# Altium schematic sheet Sheet1.SchDoc
size A
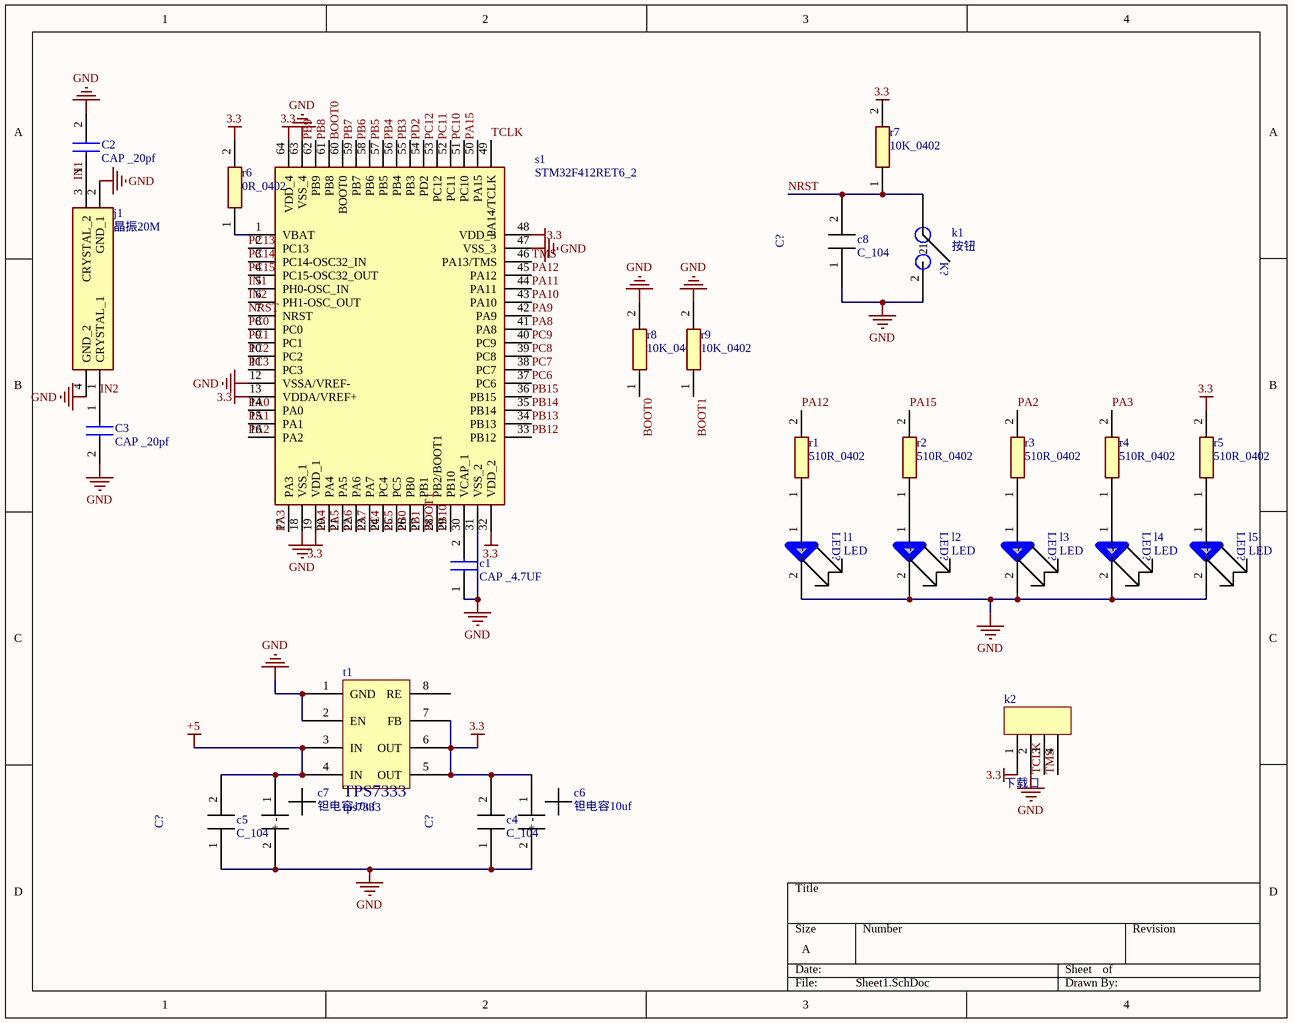
[diagram p0: Sheet1.SchDoc]

## Parts
c1  CAP _4.7UF  [cap_0402]
C2  CAP _20pf  [cap_0402]
C3  CAP _20pf  [cap_0402]
c4  C_104  [RC0603]
c5  C_104  [RC0603]
c6  钽电容10uf  [钽电容10uf 3216]
c7  钽电容10uf  [钽电容10uf 3216]
c8  C_104  [RC0603]
j1  晶振20M  [晶振20M]
k1  按钮  [SMT-KEY]
k2  下载口  [贴片4位接口]
l1  LED  [LED0805]
l2  LED  [LED0805]
l3  LED  [LED0805]
l4  LED  [LED0805]
l5  LED  [LED0805]
r1  510R_0402  [RC0402]
r2  510R_0402  [RC0402]
r3  510R_0402  [RC0402]
r4  510R_0402  [RC0402]
r5  510R_0402  [RC0402]
r6  0R_0402  [RC0402]
r7  10K_0402  [RC0402]
r8  10K_0402  [RC0402]
r9  10K_0402  [RC0402]
s1  STM32F412RET6_2  [stm32f412ret6 _2]
t1  tps7333  [SOIC-8P]

## Nets
3.3: c4.2 c6.1(+) k2.1 r5.2 r6.2 s1.13(VDDA/VREF+) s1.19(VDD_1) s1.32(VDD_2) s1.48(VDD_3) s1.64(VDD_4) t1.5(OUT) t1.6(OUT) t1.7(FB)
+5: c5.2 c7.1(+) t1.3(IN) t1.4(IN)
GND: c1.1 C2.2 C3.2 c4.1 c5.1 c6.2(-) c7.2(-) c8.1 j1.2(GND_1) j1.4(GND_2) k1.2 k2.2 l1.2(-) l2.2(-) l3.2(-) l4.2(-) l5.2(-) r8.2 r9.2 s1.12(VSSA/VREF-) s1.18(VSS_1) s1.31(VSS_2) s1.47(VSS_3) s1.63(VSS_4) t1.1(GND) t1.2(EN)
BOOT0: r8.1 s1.60(BOOT0)
BOOT1: r9.1 s1.28(PB2/BOOT1)
IN1: C2.1 j1.3(CRYSTAL_2) s1.5(PH0-OSC_IN)
IN2: C3.1 j1.1(CRYSTAL_1) s1.6(PH1-OSC_OUT)
NRST: c8.2 k1.1 r7.1 s1.7(NRST)
PA0: s1.14(PA0)
PA1: s1.15(PA1)
PA2: r3.2 s1.16(PA2)
PA3: r4.2 s1.17(PA3)
PA4: s1.20(PA4)
PA5: s1.21(PA5)
PA6: s1.22(PA6)
PA7: s1.23(PA7)
PA8: s1.41(PA8)
PA9: s1.42(PA9)
PA10: s1.43(PA10)
PA11: s1.44(PA11)
PA12: r1.2 s1.45(PA12)
PA15: r2.2 s1.50(PA15)
PB0: s1.26(PB0)
PB1: s1.27(PB1)
PB3: s1.55(PB3)
PB4: s1.56(PB4)
PB5: s1.57(PB5)
PB6: s1.58(PB6)
PB7: s1.59(PB7)
PB8: s1.61(PB8)
PB9: s1.62(PB9)
PB10: s1.29(PB10)
PB12: s1.33(PB12)
PB13: s1.34(PB13)
PB14: s1.35(PB14)
PB15: s1.36(PB15)
PC0: s1.8(PC0)
PC1: s1.9(PC1)
PC2: s1.10(PC2)
PC3: s1.11(PC3)
PC4: s1.24(PC4)
PC5: s1.25(PC5)
PC6: s1.37(PC6)
PC7: s1.38(PC7)
PC8: s1.39(PC8)
PC9: s1.40(PC9)
PC10: s1.51(PC10)
PC11: s1.52(PC11)
PC12: s1.53(PC12)
PC13: s1.2(PC13)
PC14: s1.3(PC14-OSC32_IN)
PC15: s1.4(PC15-OSC32_OUT)
PD2: s1.54(PD2)
TCLK: k2.3 s1.49(PA14/TCLK)
TMS: k2.4 s1.46(PA13/TMS)
Netc1_2: c1.2 s1.30(VCAP_1)
Netl1_1: l1.1(+) r1.1
Netl2_1: l2.1(+) r2.1
Netl3_1: l3.1(+) r3.1
Netl4_1: l4.1(+) r4.1
Netl5_1: l5.1(+) r5.1
Netr6_1: r6.1 s1.1(VBAT)

Not connected (* = marked no-connect by the designer): r7 2; t1 8(RE)

## Notes on the sheet
- Labels drawn without touching a wire or pin: 3.3
- (in symbol C_104) C?
- (in symbol LED) LED?
- (in symbol tps7333) TPS7333
- (in symbol 按钮) K?

## Library data of the parts
c1 = CAP _20pf
k2 = 贴片4位